# EAGLE schematic EEZ PSU consolidated r5B9 (EAGLE 6.1), part 2 of 2
## Sheet 11 of 12: Reset, load temp, digital input
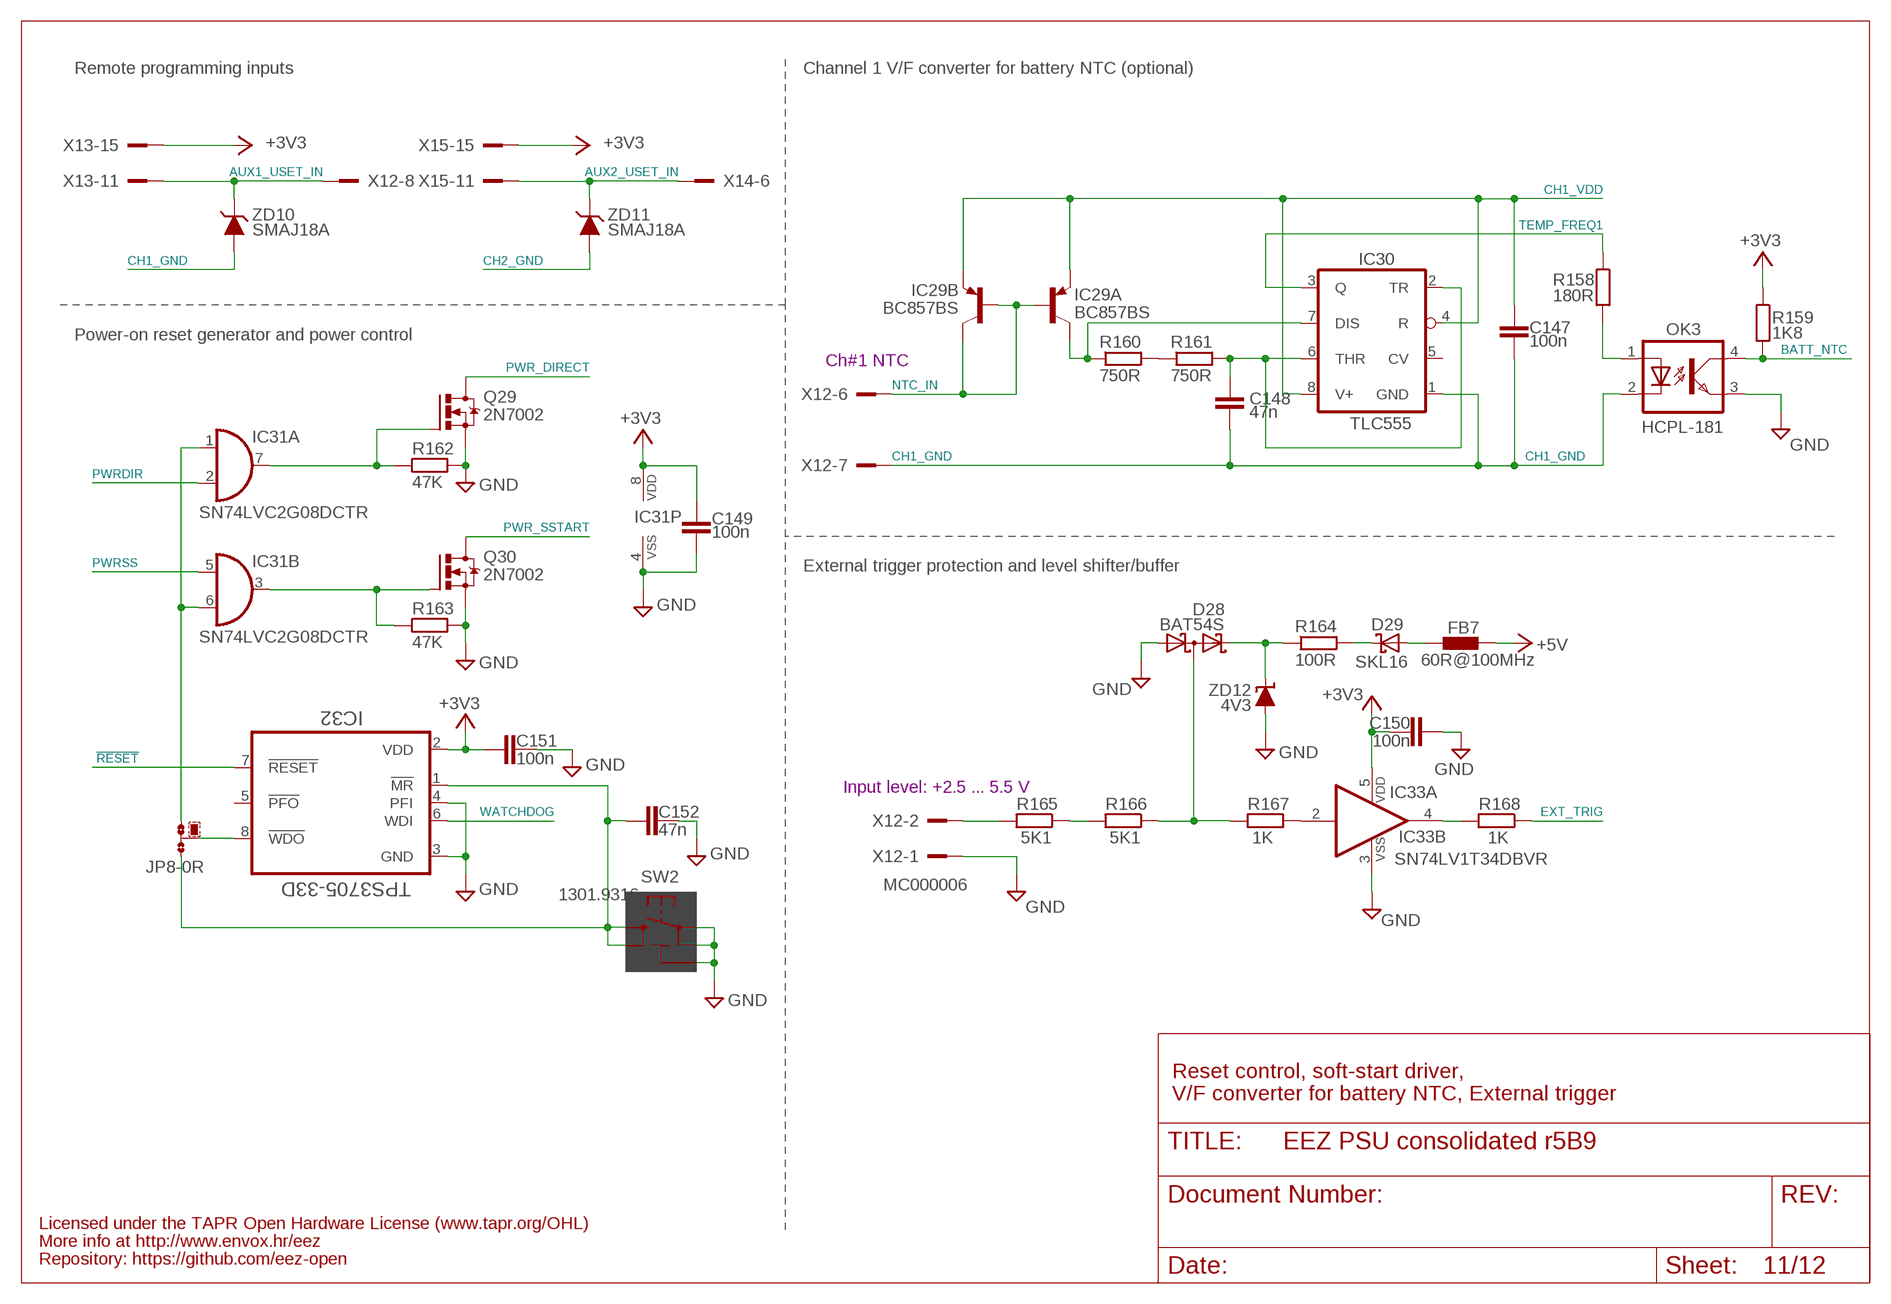
[diagram p10: schematic, sheet 11]

### Parts
C147  100n  C-EUC0603  [C0603]
C148  47n  C-EUC0805  [C0805]
C149  100n  C-EUC0603  [C0603]
C150  100n  C-EUC0603  [C0603]
C151  100n  C-EUC0603  [C0603]
C152  47n  C-EUC0805  [C0805]
D28  BAT54S  [SOT23]
D29  SKL16  SCHOTTKYSOD123  [SOD123]
FB7  60R@100MHz  FERRITE_BEAD0603  [BEAD0603]
IC29  BC857BS  [SOT65P210X110-6N]
IC30  TLC555  LM555SOIC8  [SOIC127P600X175-8N]
IC31  SN74LVC2G08DCTR  [SOP65P400X130-8N]
IC32  TPS3705-33D  TPS3705XX  [SOIC127P600X175-8N]
IC33  SN74LV1T34DBVR  SN74LV1T34  [SOT95P280X145-5N]
JP8  0R-JUMPA  [A0R-JMP]
OK3  HCPL-181  [HCPL-181]
Q29  2N7002  [SOT103P240X110-3N]
Q30  2N7002  [SOT103P240X110-3N]
R158  180R  R-EU_R0805  [R0805]
R159  1K8  R-EU_R0805  [R0805]
R160  750R  R-EU_R0805  [R0805]
R161  750R  R-EU_R0805  [R0805]
R162  47K  R-EU_R0805  [R0805]
R163  47K  R-EU_R0805  [R0805]
R164  100R  R-EU_R0805  [R0805]
R165  5K1  R-EU_R0805  [R0805]
R166  5K1  R-EU_R0805  [R0805]
R167  1K  R-EU_R0805  [R0805]
R168  1K  R-EU_R0805  [R0805]
SW2  1301.9316  TACT_SW  [TACTM-6XN]
ZD10  SMAJ18A  PSMAXX  [DO214AC]
ZD11  SMAJ18A  PSMAXX  [DO214AC]
ZD12  4V3  ZENER-DIODEMINIMELF  [MINIMELF]

### Nets
!MR: C152.2 IC32.1(!MR) JP8.1 SW2.3 SW2.4
!RESET: IC32.7(!RESET) ; also sheet 9,10,12
!RESET1: IC31.1(A:I0) IC31.6(B:I1) JP8.3
+3V3: C149.2 C150.1 C151.2 IC31.8(P:VDD) IC32.2(VDD) IC33.5(B:VDD) R159.1 X13.15 X15.15 ; also sheet 8,9,10,12
+5V: FB7.P$1 ; also sheet 2,3,4,5,6,7,8,9,10,12
AUX1_USET_IN: X12.8 X12.8.1 X13.11 ZD10.C
AUX2_USET_IN: X14.6 X14.6.1 X15.11 ZD11.C
BATT_NTC: OK3.4(COL) R159.2 ; also sheet 9
CH1_GND: C147.2 C148.1 IC30.1(GND) OK3.2(C) X12.7 X12.7.1 ZD10.A ; also sheet 9
CH1_VDD: C147.1 IC29.1(A:E) IC29.4(B:E) IC30.4(R) IC30.8(V+) ; also sheet 9
CH2_GND: ZD11.A ; also sheet 8,9
EXT_TRIG: R168.1 ; also sheet 9
GND [gnd]: C149.1 C150.2 C151.1 C152.1 D28.1(A1) IC31.4(P:VSS) IC32.3(GND) IC32.4(PFI) IC33.3(B:VSS) OK3.3(EMIT) Q29.2(S) Q30.2(S) R162.2 R163.2 SW2.1 SW2.2 SW2.5(5-GND) X12.1 X12.1.1 ZD12.A ; also sheet 1,2,3,4,5,6,7,8,9,10,12
N$82: IC31.7(A:O) Q29.1(G) R162.1
N$136: C148.2 IC30.2(TR) IC30.6(THR) R161.2
N$137: IC29.6(A:C) IC30.7(DIS) R160.1
N$138: OK3.1(A) R158.2
N$139: D28.3(C1A2) R166.1 R167.2
N$140: IC33.2(A:I) R167.1
N$141: IC33.4(A:O) R168.2
N$142: R165.2 X12.2 X12.2.1
N$144: D28.2(C2) R164.1 ZD12.C
N$148: D29.C R164.2
N$149: D29.A FB7.P$2
N$151: IC32.8(!WDO) JP8.2
N$154: IC31.3(B:O) Q30.1(G) R163.1
N$164: R165.1 R166.2
N$172: R160.2 R161.1
NTC_IN: IC29.2(A:B) IC29.3(B:C) IC29.5(B:B) X12.6 X12.6.1
PWR_DIRECT: Q29.3(D) ; also sheet 9
PWR_SSTART: Q30.3(D) ; also sheet 9
PWRDIR: IC31.2(A:I1) ; also sheet 9
PWRSS: IC31.5(B:I0) ; also sheet 9
TEMP_FREQ1: IC30.3(Q) R158.1
WATCHDOG: IC32.6(WDI) ; also sheet 9
Unconnected: IC30.5(CV) IC32.5(!PFO)

### Notes on the sheet
- Remote programming inputs | Channel 1 V/F converter for battery NTC (optional)
- Power-on reset generator and power control
- Ch#1 NTC
- External trigger protection and level shifter/buffer
- Input level: +2.5 ... 5.5 V
- Reset control, soft-start driver,
- V/F converter for battery NTC, External trigger
- Licensed under the TAPR Open Hardware License (www.tapr.org/OHL)
- More info at http://www.envox.hr/eez
- Repository: https://github.com/eez-open

## Sheet 12 of 12: Optional conn., Master sync
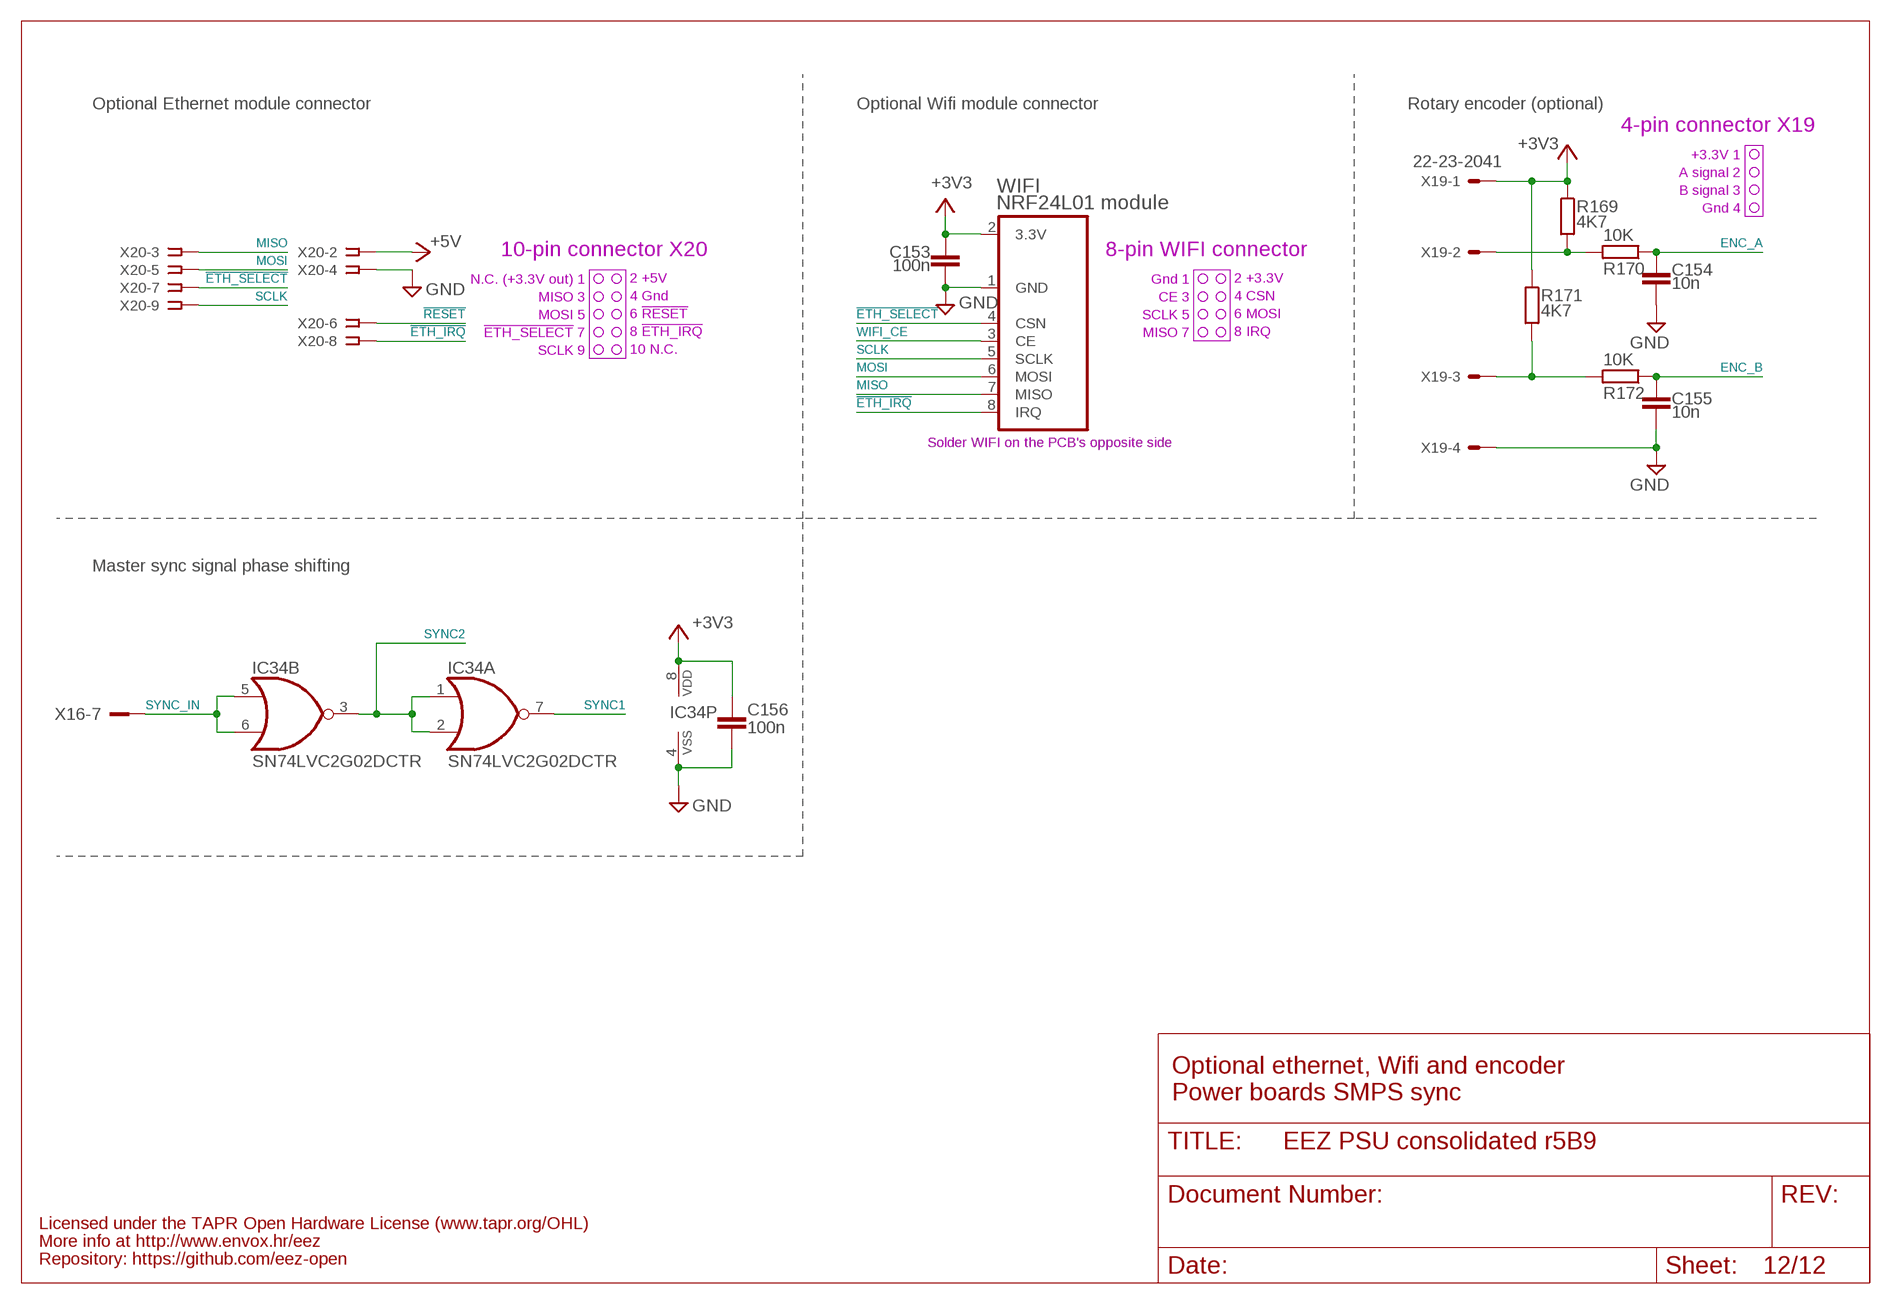
[diagram p11: schematic, sheet 12]

### Parts
C153  100n  C-EUC0603  [C0603]
C154  10n  C-EUC0805  [C0805]
C155  10n  C-EUC0805  [C0805]
C156  100n  C-EUC0603  [C0603]
IC34  SN74LVC2G02DCTR  [SOP65P400X130-8N]
R169  4K7  R-EU_R0805  [R0805]
R170  10K  R-EU_R0805  [R0805]
R171  4K7  R-EU_R0805  [R0805]
R172  10K  R-EU_R0805  [R0805]
WIFI  NRF24L01 module  MOD-NRF24L01MIRROR  [MOD-NRF24L01_MIRROR]
X19  22-23-2041  [22-23-2041]
X20  SSW-105-02-S-D  [SSW-105-02-S-D]

### Nets
!ETH_IRQ: WIFI.8(IRQ) X20.8 ; also sheet 9,10
!ETH_SELECT: WIFI.4(CSN) X20.7 ; also sheet 9,10
!RESET: X20.6 ; also sheet 9,10,11
+3V3: C153.1 C156.1 IC34.8(P:VDD) R169.1 R171.1 WIFI.2(3.3V) X19.1 ; also sheet 8,9,10,11
+5V: X20.2 ; also sheet 2,3,4,5,6,7,8,9,10,11
ENC_A: C154.2 R170.1 ; also sheet 9
ENC_B: C155.1 R172.1 ; also sheet 9
GND [gnd]: C153.2 C154.1 C155.2 C156.2 IC34.4(P:VSS) WIFI.1(GND) X19.4 X20.4 ; also sheet 1,2,3,4,5,6,7,8,9,10,11
MISO: WIFI.7(MISO) X20.3 ; also sheet 9,10
MOSI: WIFI.6(MOSI) X20.5 ; also sheet 8,9,10
N$157: R169.2 R170.2 X19.2
N$159: R171.2 R172.2 X19.3
SCLK: WIFI.5(SCLK) X20.9 ; also sheet 8,9,10
SYNC1: IC34.7(A:O) ; also sheet 9
SYNC2: IC34.1(A:I0) IC34.2(A:I1) IC34.3(B:O) ; also sheet 9
SYNC_IN: IC34.5(B:I0) IC34.6(B:I1) X16.7
WIFI_CE: WIFI.3(CE) ; also sheet 9
Unconnected: X20.1 X20.10

### Notes on the sheet
- Optional Ethernet module connector | Optional Wifi module connector | Rotary encoder (optional)
- 4-pin connector X19
- +3.3V 1
- A signal 2
- B signal 3
- Gnd 4
- 10-pin connector X20 | 8-pin WIFI connector
- N.C. (+3.3V out) 1 | Gnd 1
- 2 +5V | 2 +3.3V
- MISO 3 | CE 3
- 4 Gnd | 4 CSN
- MOSI 5 | SCLK 5
- 6 !RESET | 6 MOSI
- !ETH_SELECT! 7 | MISO 7
- 8 !ETH_IRQ | 8 IRQ
- SCLK 9
- 10 N.C.
- Solder WIFI on the PCB's opposite side
- Master sync signal phase shifting
- Optional ethernet, Wifi and encoder
- Power boards SMPS sync
- Licensed under the TAPR Open Hardware License (www.tapr.org/OHL)
- More info at http://www.envox.hr/eez
- Repository: https://github.com/eez-open

## Library data of the parts
C1-C3 C6-C15 C17 C19-C26 C28-C34 C36-C42 C44-C66 C68-C96 C98-C105 C107-C110 C112-C118 C121-C126 C128-C143 C146-C156 = rcl:C-EU: CAPACITOR, European symbol
C4 C5 C18 C27 C35 C43 C67 C97 C119 C144 C145 = EEZ_Lib1:ECAP
C16 = Panasonic-EEEFK_EEEFP:EEE-: Aluminum Electrolytic Capacitors,Surface Mount Type; MPN: EEE-FK1J470P; OC_FARNELL: 9696032; OC_NEWARK: 96K9403; PACKAGE: CASE-F; SUPPLIER: PANASONIC; TOLERANCE: ±20 %; VALUE: 47UF; VOLTAGERATING: 63 V
C106 C111 C120 = MyLib6:ECAP
C127 = EEZ_Lib1:SUPER_CAP: Electric Double Layer Supercapacitors, Type EDL Vertical - Manufacturer Part No: EDLSG105V5R5C Farnell: 2113011 Horizontal - Manufacturer Part No: EDLSG105H5R5C Farnell: 1364209, 9697497
D1-D4 = EEZ_Lib1:VS-6CWQ06FNPBF: Schottky Rectifier, 2 x 3.5 A
D5 D7-D10 D19 D20 D29 = EEZ_Lib1:SCHOTTKY
D6 D11-D18 D21-D25 D27 = diode:DIODE-: DIODE
D26 = MyLib6:DIODE
D28 = diode:BAT54S: Schottky Diodes Pin connection corrected 2011-05-04 Source: Fairchild .. BAT54.pdf
FB1-FB3 FB7 = EEZ_Lib1:FERRITE_BEAD: FAIR-RITE - 2506033007Y3 - FERRITE BEAD, 0.04OHM, 3A, 0603 Farnell: 2112873
FB4-FB6 = MyLib6:FERRITE_BEAD: FAIR-RITE - 2506033007Y3 - FERRITE BEAD, 0.04OHM, 3A, 0603 Farnell: 2112873
FM1-FM6 = EEZ_Lib1:FIDUCIAL: Fiducial mark for pick and place automation
GND SW = EEZ_Lib1:PCB_TEST_TAB
IC1 = EEZ_Lib1:LTC3864: 60V Low Iq Step-Down DC/DC Controller with 100% Duty Cycle Capability
IC2 = EEZ_Lib1:MC79LXX: 3-terminal negative voltage regulator, up to 100mA
IC3 = EEZ_Lib1:MC78LXX: μA78L00 series positive voltage regulators
IC4 = EEZ_Lib1:LM5574: Step-Down Switching Regulator; MPN: LM5574MT; OC_FARNELL: 1325419; OC_NEWARK: 32M1267; PACKAGE: TSSOP-16; SUPPLIER: National Semiconductors
IC5 = EEZ_Lib1:LP2951: LP2950-N/LP2951-N Series of Adjustable Micropower Voltage Regulators
IC6 IC7 = EEZ_Lib1:TL072
IC8 = EEZ_Lib1:OP27GSZ: Low Noise, Precision Operational Amplifier
IC9 = EEZ_Lib1:MCP23S08: 8-Bit I/O Expander with SPI; DESCRIPTION: IC I/O EXPANDER; MPN: MCP23S08-E/SO; OC_FARNELL: 1332092; OC_NEWARK: 08J8733; PACKAGE: SOIC-18; SUPPLIER: Microchip
IC10 = EEZ_Lib1:REF50XX: Low-Noise (3μVpp/V), Very Low Drift (max. 8ppm/°C), Precision Voltage Reference Pin compatible with REF2 Farnell: 1439628
IC11 = EEZ_Lib1:DAC8552_DGK_8
IC12 = EEZ_Lib1:ADG465: Single Channel Protector in an SOT-23 Package
IC13 = EEZ_Lib1:TS5A9411DCKT: 10-Ω SPDT ANALOG SWITCH SINGLE-CHANNEL 2:1 MULTIPLEXER/DEMULTIPLEXER; FARNELL: 1755582
IC14 = EEZ_Lib1:ADS1120: Low-Power, Low-Noise, 16-Bit, Analog-to-Digital Converter for Small-Signal Sensors Farnell: 2402249
IC15 = EEZ_Lib1:LM339: Low Power Low Offset Voltage Quad Comparators with open collector; LM139/LM239/LM339/LM2901/LM3302
IC16 = EEZ_Lib1:LM(2)5575: Simple Switcher® 42V, 1.5A Step-Down Switching Regulator
IC17 = EEZ_Lib1:TPD4E002: Low-Capacitance 4-Channel +/-15-kV ESD Protection Array for High-Speed Data Interfaces
IC18 = EEZ_Lib1:TPD2E001: Low-Capacitance 2-Channel +/-15 kV ESD-Protection Array for High-Speed Data Interfaces
IC19 = MyLib6:ADUM3160BRWZ: Full/Low Speed 2.5 kV USB Digital Isolator
IC20 = MyLib6:TLC5925IDBQR: CONSTANT-CURRENT LED SINK DRIVER; MPN: TLC5925IDBQR; OC_FARNELL: 1694438; OC_NEWARK: 46P3784; PACKAGE: SOP-24; SUPPLIER: Texas Instruments
IC21 IC25 = EEZ_Lib1:SI8641: Low power 4-ch digital isolator (3+1) Farnell: 2423288
IC22 IC23 = EEZ_Lib1:SI8651: Low power 5-ch digital isolator (4+1); FARNELL: 2423323
IC24 = v-reg:LD117A?*: Low drop fixed and adjustable positive voltage regulators 1 A Source: http://www.st.com/stonline/products/literature/ds/7194/ld1117axx.pdf
IC26 = MyLib6:PCA21125: SPI-bus Real-Time Clock and calendar Farnell: 2400445
IC27 = MyLib6:AT25XXX: SPI Serial EEPROM, Supports SPI Modes 0 (0,0) and 3 (1,1) Atmel AT25128 128K (16 384 x 8) Farnell: 2345601 Atmel AT25256 256K (32 768 x 8) Farnell: 1841577 Atmel AT25512 512K (65 536 x 8) Farnell: 2345608
IC28 = EEZ_Lib1:W5500: The W5500 chip is a Hardwired TCP/IP embedded Ethernet controller that enables easier internet connection for embedded systems using SPI (Serial Peripheral Interface). Case TQFP48; TME: W5500
IC29 = MyLib6:BC857BS: PNP general purpose dual transistor
IC30 = MyLib6:LM555
IC31 = EEZ_Lib1:SN74LVC2G08DCTR: DUAL 2-INPUT POSITIVE-AND GATE; MPN: SN74LVC2G08DCTR; OC_FARNELL: 1470871; OC_NEWARK: 68K1120; PACKAGE: SSOP-8; SUPPLIER: Texas Instruments
IC32 = EEZ_Lib1:TPS3705XX: Processor supervisory circuit with power-fail; FARNELL: 2296066
IC33 = EEZ_Lib1:SN74LV1T34: Single Power Supply Single Buffer GATE CMOS Logic Level Shifter; FARNELL: 2499914
IC34 = EEZ_Lib1:SN74LVC2G02DCTR: NOR Gate, LVC Family, 2 Input, 32 mA, 1.65V to 5.5V, SSOP-8
J1-J5 = EEZ_Lib1:BINDING_POST
JP1 JP2 JP4-JP8 = jump-0r-smd:0R-JUMP: SMD 0R 0805 Jumper
JP3 = jumper:JP1E: JUMPER
K_PAR K_SER = EEZ_Lib1:RELAY_RT314012
K_S1 K_S2 = relay:G6K: Low Signal Relay oeiwcsnts1.omron.com/.. D20G6K0100.pdf; MF: OMRON COMPONENTS USA; MPN: G6K-2F DC24; OC_FARNELL: 1690427; OC_NEWARK: 36K7467
KK1 = EEZ_Lib1:SK145: FISCHER ELEKTRONIK SK 145/37,5 STS-220 Heat Sink, TO-220, TO-218, TO-220, TO-247, TO-248, 12 °C/W, 29 mm, 12 mm
L1 = EEZ_Lib1:RN114: Schaffner EMC/EMI current-compensated chokes, horizontal case; FARNELL: 1191484
L2 = WE-HCI:WE-HCI: SMD-Flat Wire High Current Inductor WE-HCI - Flat wire coil for lower losses at high frequency ranges - Low leakage field - Extremely low profile design - Current loading up to 40 A - Magnetically shielded -- Graphic cards -- Laptops -- Motherboards -- High current switching regulators -- Polyphase-switching regulators -- industrial computers; MPN: 7443551331; OC_FARNELL: 2211631; OC_NEWARK: 44W4647; PACKAGE: 1365; SUPPLIER: Würth Elektronik eiSos GmbH
L3 L4 = EEZ_Lib1:IHLP-2020BZ-11: Low Profile, High Current IHLP® Inductors
L5-L8 = EEZ_Lib1:L1210
L9 = EEZ_Lib1:COILCRAFT_MSS1278: Coilcraft SMT Power Inductors – MSS1278
L10 = EEZ_Lib1:DE0704: Ferrocore SMD power coil 7.3 x 7.3 mm
LCD1 = EEZ_Lib1:LCD_TFT_320QVT: 3.2" 320x240 TFT Module Display Touch Panel with PCB 262K Colors IC SSD1289
LED1 LED_CC1 LED_CC2 LED_CV1 LED_CV2 LED_O1 LED_O2 LED_PROG1 LED_PROG2 LED_PWR LED_S1 LED_S2 LED_SP = EEZ_Lib1:LED
MCU = EEZ_Lib1:ARDUINO_MEGA+ICSP
NTC1 = EEZ_Lib1:NTC
OK1 = EEZ_Lib1:MOC305X: 6-pin DIP Random-phase Optoisolators Triac Drivers (600V Peak)
OK2 = optocoupler:MOC30*: 6-Pin DIP Zero-Cross Optoisolators Triac Driver Output (250/400 Volt Peak) Source: http://www.fairchildsemi.com/ds/MO/MOC3043-M.pdf; MF: FAIRCHILD SEMICONDUCTOR; MPN: MOC3033S-M; OC_FARNELL: unknown; OC_NEWARK: 05C2878
OK3 = EEZ_Lib1:HCPL-181: Phototransistor Optocoupler SMD Mini-Flat Type
Q1 Q8 = EEZ_Lib1:P-MOSFET: HEXFET Power MosFet Source: http://www.irf.com/
Q2 Q5 Q10 Q11 Q17 = transistor:*-PNP-: PNP Transistror
Q3 Q15 = EEZ_Lib1:2N7002: N-CHANNEL ENHANCEMENT MODE FIELD EFFECT TRANSISTOR; MPN: 2N7002-7-F; OC_FARNELL: 1713823; OC_NEWARK: 25R5679; PACKAGE: SOT-23-3; SUPPLIER: DIODES INC.
Q4 = EEZ_Lib1:IRFP240: HEXFET Power MosFet Source: http://www.irf.com/
Q6 Q12 Q13 Q16 Q18 Q19 = transistor:*-NPN-: NPN Transistror BF959 corrected 2008.03.06
Q7 Q9 = EEZ_Lib1:BCP56: Low power NPN Transistor, Vceo=80V, Ic=1A, SOT-223
Q14 = EEZ_Lib1:IRLML2246TRPBF: HEXFET Power MOSFET (-20V, -2.6A); MPN: IRLML2246TRPBF; OC_FARNELL: 1888166; OC_NEWARK: 40T7450; PACKAGE: SOT-3; SUPPLIER: International Rectifier; TME: IRLML2246TRPBF
Q20 Q21 = triac:BTA26: 25A TRIAC Source: http://www.st.com/stonline/products/literature/ds/7470.pdf
Q22 = transistor-power:N-HEXFET-2D_?-*: HEXFET® Power MOSFET 2 Drain connects http://www.irf.com/product-info/datasheets/data/irll014n.pdf
Q23-Q26 Q28 = MyLib6:IRLML2246TRPBF: HEXFET Power MOSFET (-20V, -2.6A); MPN: IRLML2246TRPBF; OC_FARNELL: 1888166; OC_NEWARK: 40T7450; PACKAGE: SOT-3; SUPPLIER: International Rectifier; TME: IRLML2246TRPBF
Q27 Q29 Q30 = MyLib6:2N7002: N-CHANNEL ENHANCEMENT MODE FIELD EFFECT TRANSISTOR; MPN: 2N7002-7-F; OC_FARNELL: 1713823; OC_NEWARK: 25R5679; PACKAGE: SOT-23-3; SUPPLIER: DIODES INC.
R1-R106 R108-R172 = rcl:R-EU_: RESISTOR, European symbol
R107 = EEZ_Lib1:R_EU: RESISTOR - European symbol
RN1 RN2 = EEZ_Lib1:R_ARRAY4: 1206 four resistor array
SAR1 = EEZ_Lib1:SAR: EPCOS surge arrester EF470X Farnell: 1886596
SH1-SH3 = EEZ_Lib1:SHORT
SP1 = EEZ_Lib1:BUZZER: Loudity LD-BZEN-0903 Sound transducer: electromagnetic; without built-in generator; TME: LD-BZEN-0903
SW1 = switch:M9040P: TOGGLE SWITCH Marquardt
SW2 = EEZ_Lib1:TACT_SW
TP1-TP3 = EEZ_Lib1:TEST_POINT: Test point for oscilloscope probe
TR1 = EEZ_Lib1:BOURNS_SRF0703INV: Bourns SRF0703 Series - Dual-Winding Shielded Power Inductors
TR2 = EEZ_Lib1:AC_DC_ADAPTER: MYRRA 47202 AC/DC PCB Mount Power Supply, Switch Mode, Fixed, 1 Output
VAR1 VAR2 = EEZ_Lib1:VARISTOR: EPCOS - B72220S0251K101 - VARISTOR, 140J, 250VAC Farnell: 1004357
WIFI = EEZ_Lib1:MOD-NRF24L01: Nordic nRF24L01, highly integrated, ultra low power (ULP) 2Mbps RF transceiver for the 2.4GHz
X1 = EEZ_Lib1:MINIFIT-3PIN: MOLEX 39303035 Wire-To-Board Connector, Single In Line, Mini-Fit Jr 5569 Series, 3 Contacts, Plug, 4.2 mm; FARNELL: 9963545
X2 = EEZ_Lib1:TBLOCK5.0_2A
X3 = EEZ_Lib1:SSW-113-02-T-D-RA: Samtec SSW-113-02-T-D-RA Receptacle, 2.54MM, RA, 26-way; FARNELL: 1805583; TME: ZL263-26DG
X4 = EEZ_Lib1:MINIFIT_6659-5: MOLEX 39303035 Wire-To-Board Connector, Single In Line, Mini-Fit Jr 5569 Series, 5 Contacts, Plug, 4.2 mm
X5 X16 = EEZ_Lib1:IDC-10PIN: 10-pin IDC socket male, straight; TME: T821-1-10-S1
X6 = con-molex:22-23-2031: .100" (2.54mm) Center Header - 3 Pin; MF: MOLEX; MPN: 22-23-2031; OC_FARNELL: 1462950; OC_NEWARK: 30C0862
X7 = EEZ_Lib1:RJ45-VERT: AMPHENOL LMJ2138812S0LOT6C Socket; RJ45; PIN:8; vertical, shielded, with LED and trafo
X8 X18 = con-samtec:SSW-108-02-S-S: THROUGH-HOLE .025" SQ POST SOCKET Source: Samtec SSW.pdf; MPN: SSW-108-02-S-S; OC_FARNELL: unknown; OC_NEWARK: 11P9448
X9 X10 = con-samtec:SSW-105-02-S-S: THROUGH-HOLE .025" SQ POST SOCKET Source: Samtec SSW.pdf; MPN: SSW-105-02-S-S; OC_FARNELL: unknown; OC_NEWARK: 11P9399
X11 = con-kycon:KUSBVX-BS1N: USB B-type Receptacle Vertical, 4 Position, Through Hole Source: Sibalco Kycon KUSBVX-BS1N-xxx.pdf
X12 = EEZ_Lib1:MC000006: Wire-To-Board Terminal Block, 8, 150 V, 6 A, 26 AWG, 20 AWG No. of Positions:8; Rated Voltage:150V; Rated Current:6A; FARNELL: 2007972
X13 X15 = EEZ_Lib1:TSW-113-07-F-D: Samtec TSW-110-07-F-D Header, 2.54MM, THT, 26-way; FARNELL: 2025182
X14 = EEZ_Lib1:MC000005: Wire-To-Board Terminal Block, 6, 150 V, 6 A, 26 AWG, 20 AWG No. of Positions:6; Rated Voltage:150V; Rated Current:6A
X17 = con-molex:22-23-2021: .100" (2.54mm) Center Header - 2 Pin; MF: MOLEX; MPN: 22-23-2021; OC_FARNELL: 1462926; OC_NEWARK: 25C3832
X19 = con-molex:22-23-2041: .100" (2.54mm) Center Header - 4 Pin; MF: MOLEX; MPN: 22-23-2041; OC_FARNELL: 1462920; OC_NEWARK: 38C0355
X20 = con-samtec:SSW-105-02-S-D: THROUGH-HOLE .025" SQ POST SOCKET Source: Samtec SSW.pdf; MPN: SSW-105-02-S-D; OC_FARNELL: unknown; OC_NEWARK: 11P9398
Y1 Y2 = MyLib6:XTAL
ZD1-ZD3 = EEZ_Lib1:P6SMB68A: Transient Voltage Suppression Diodes, DO-214AA
ZD4 ZD5 ZD12 = EEZ_Lib1:ZENER-DIODE
ZD6 ZD7 = EEZ_Lib1:1.5KE-BIDIR
ZD8-ZD11 = EEZ_Lib1:PSMAXX: Transient Voltage Suppressor, TVS, P4SMA Series, Unidirectional

## Net classes
0 default: width 0.254 mm, drill 0.584 mm, clearance 0.254 mm
1 dgnd: width 0.254 mm, drill 0.584 mm, clearance 0.254 mm
2 gnd: width 0.254 mm, drill 0.584 mm, clearance 0.254 mm